# EAGLE design stmboard (EAGLE 9.3.2)
CNAME: Kiss Tamás; CREVISION: 2.0
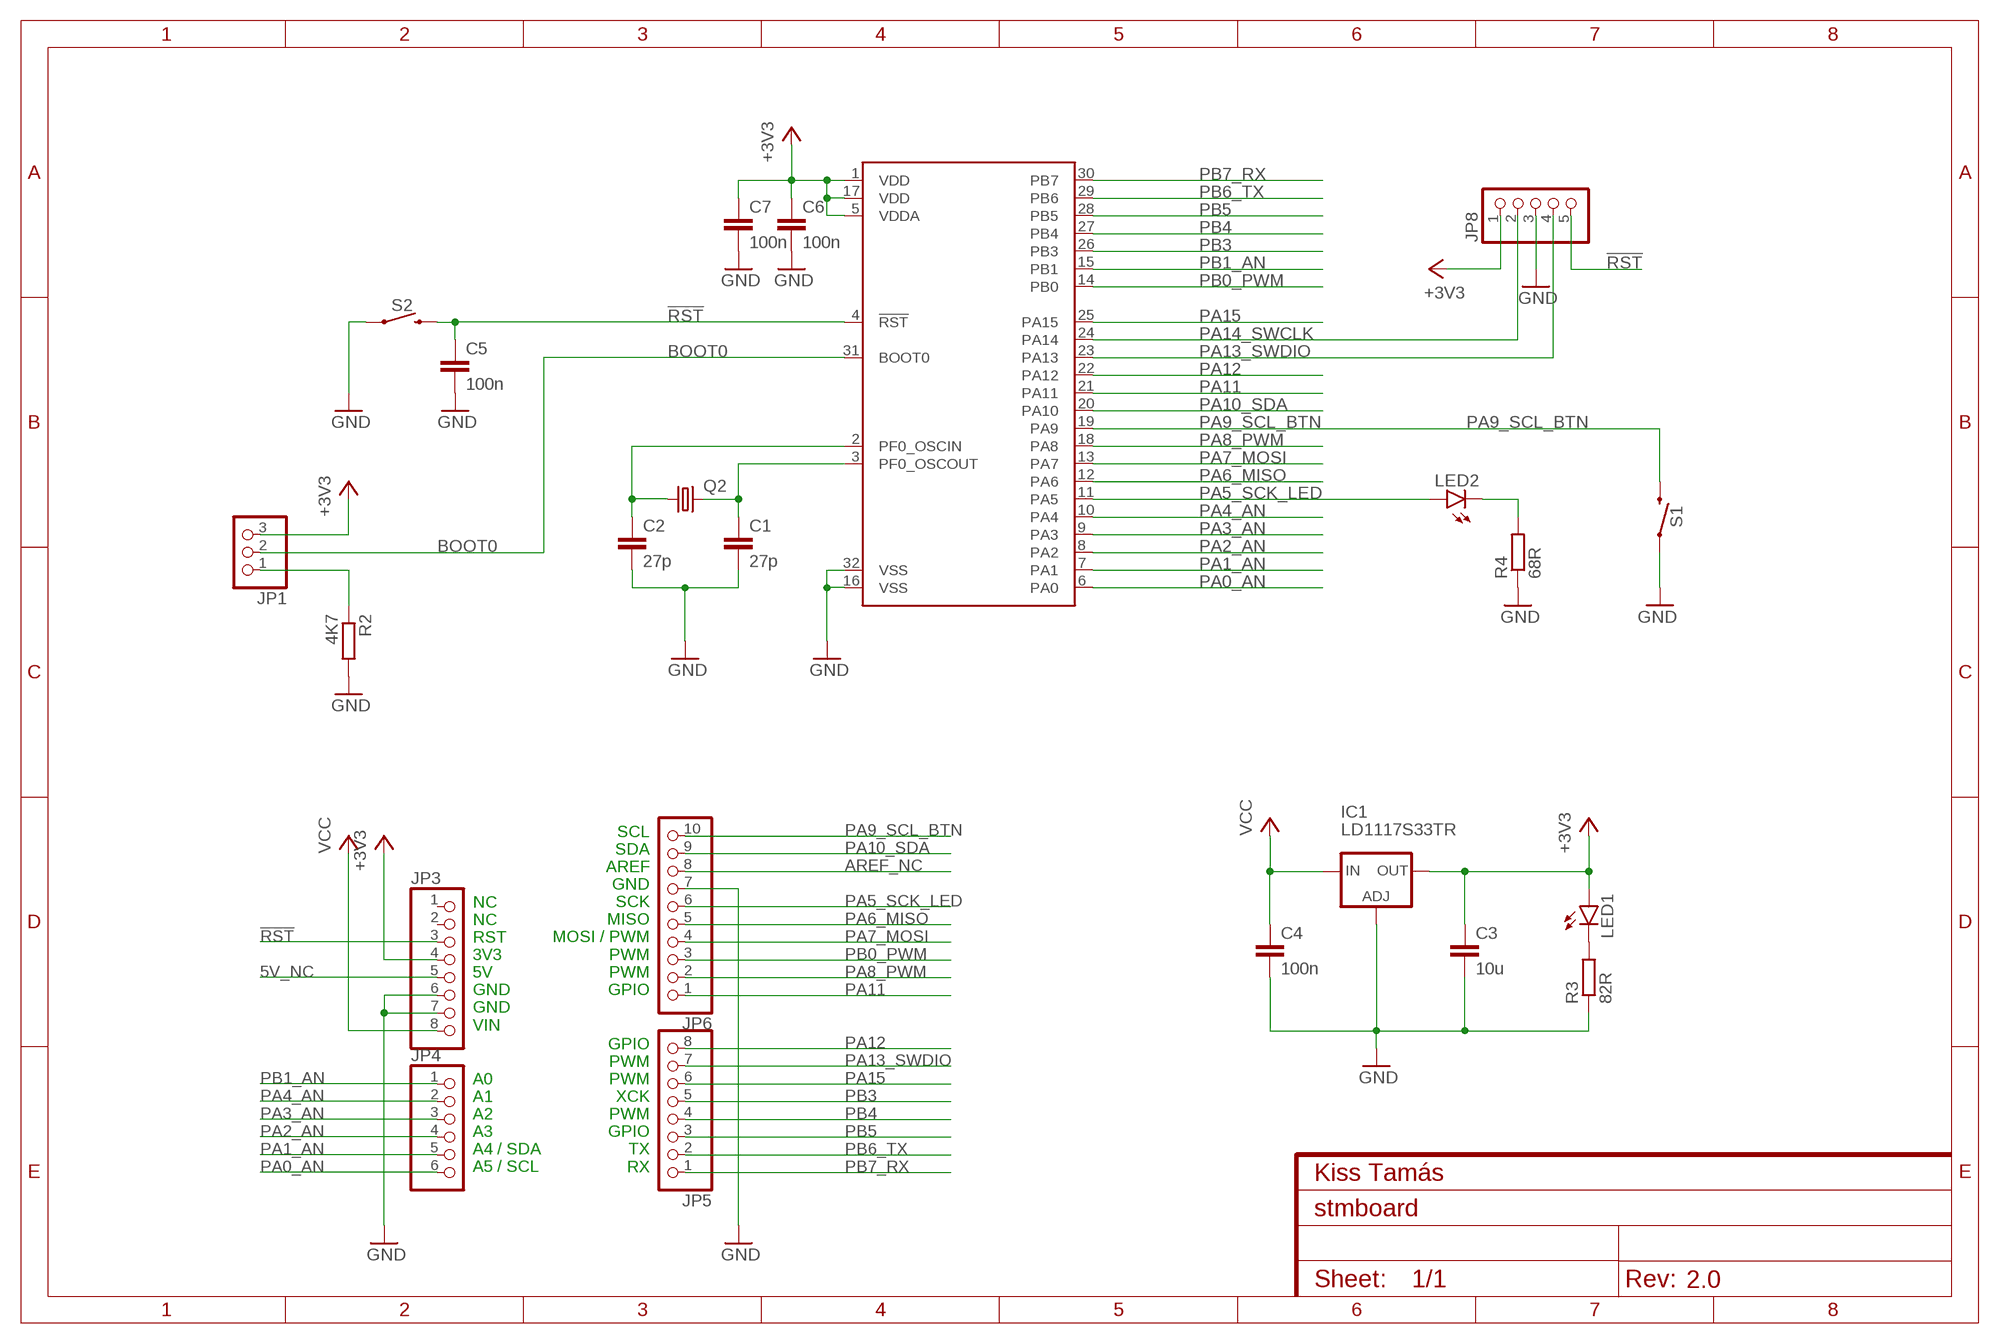
[diagram p0: schematic, sheet 1]

## Parts
C1  27p  C-EUC1206  [C1206]
C2  27p  C-EUC1206  [C1206]
C3  10u  C-EUC1206K  [C1206K]
C4  100n  C-EUC1206K  [C1206K]
C5  100n  C-EUC1206K  [C1206K]
C6  100n  C-EUC1206K  [C1206K]
C7  100n  C-EUC1206K  [C1206K]
IC1  LD1117S33TR  LD117AS12TR  [SOT223]
JP1  PINHD-1X3  [1X03]
JP3  PINHD-1X8  [1X08]
JP4  PINHD-1X6  [1X06]
JP5  PINHD-1X8  [1X08]
JP6  PINHD-1X10  [1X10]
JP8  PINHD-1X5  [1X05]
LED1  LEDSMT1206  [1206]
LED2  LEDSMT1206  [1206]
Q2  CRYSTALSM49  [SM49]
R2  4K7  R-EU_M1206  [M1206]
R3  82R  R-EU_M1206  [M1206]
R4  68R  R-EU_M1206  [M1206]
S1  MOMENTARY-SWITCH-SPST-SMD-6.0X3.5MM  [TACTILE_SWITCH_SMD_6.0X3.5MM]
S2  MOMENTARY-SWITCH-SPST-SMD-6.0X3.5MM  [TACTILE_SWITCH_SMD_6.0X3.5MM]
U$1  STM32F030  [TQFP32-08]

## Nets
5V_NC: JP3.5
!RST: C5.1 JP3.3 JP8.5 S2.2 U$1.4(!RST)
+3V3: C3.1 C6.1 C7.1 IC1.4(OUT) JP1.3 JP3.4 JP8.1 LED1.A U$1.1(VDD) U$1.5(VDDA) U$1.17(VDD)
AREF_NC: JP6.8
BOOT0: JP1.2 U$1.31(BOOT0)
GND: C1.2 C2.2 C3.2 C4.2 C5.2 C6.2 C7.2 IC1.1(ADJ) JP3.6 JP3.7 JP6.7 JP8.3 R2.2 R3.1 R4.1 S1.1 S2.1 U$1.16(VSS) U$1.32(VSS)
N$1: LED1.C R3.2
N$2: LED2.C R4.2
N$3: JP1.1 R2.1
OSCI: C2.1 Q2.1 U$1.2(PF0_OSCIN)
OSCO: C1.1 Q2.2 U$1.3(PF0_OSCOUT)
PA0_AN: JP4.6 U$1.6(PA0)
PA1_AN: JP4.5 U$1.7(PA1)
PA2_AN: JP4.4 U$1.8(PA2)
PA3_AN: JP4.3 U$1.9(PA3)
PA4_AN: JP4.2 U$1.10(PA4)
PA5_SCK_LED: JP6.6 LED2.A U$1.11(PA5)
PA6_MISO: JP6.5 U$1.12(PA6)
PA7_MOSI: JP6.4 U$1.13(PA7)
PA8_PWM: JP6.2 U$1.18(PA8)
PA9_SCL_BTN: JP6.10 S1.2 U$1.19(PA9)
PA10_SDA: JP6.9 U$1.20(PA10)
PA11: JP6.1 U$1.21(PA11)
PA12: JP5.8 U$1.22(PA12)
PA13_SWDIO: JP5.7 JP8.4 U$1.23(PA13)
PA14_SWCLK: JP8.2 U$1.24(PA14)
PA15: JP5.6 U$1.25(PA15)
PB0_PWM: JP6.3 U$1.14(PB0)
PB1_AN: JP4.1 U$1.15(PB1)
PB3: JP5.5 U$1.26(PB3)
PB4: JP5.4 U$1.27(PB4)
PB5: JP5.3 U$1.28(PB5)
PB6_TX: JP5.2 U$1.29(PB6)
PB7_RX: JP5.1 U$1.30(PB7)
VCC: C4.1 IC1.3(IN) JP3.8
Unconnected: JP3.1 JP3.2

## Notes on the sheet
- SCL
  SDA
  AREF
  GND
  SCK
  MISO
  MOSI / PWM
  PWM
  PWM
  GPIO
- NC
  NC
  RST
  3V3
  5V
  GND
  GND
  VIN
- A0
  A1
  A2
  A3
  A4 / SDA
  A5 / SCL
- GPIO
  PWM
  PWM
  XCK
  PWM
  GPIO
  TX
  RX

## Library data of the parts
C1-C7 = rcl:C-EU: CAPACITOR, European symbol
IC1 = v-reg:LD117A?*: Low drop fixed and adjustable positive voltage regulators 1 A Source: http://www.st.com/stonline/products/literature/ds/7194/ld1117axx.pdf
JP1 = pinhead:PINHD-1X3: PIN HEADER
JP3 JP5 = pinhead:PINHD-1X8: PIN HEADER
JP4 = pinhead:PINHD-1X6: PIN HEADER
JP6 = pinhead:PINHD-1X10: PIN HEADER
JP8 = pinhead:PINHD-1X5: PIN HEADER
LED1 LED2 = led:LED: LED OSRAM: - CHIPLED LG R971, LG N971, LY N971, LG Q971, LY Q971, LO R971, LY R971 LH N974, LH R974 LS Q976, LO Q976, LY Q976 LO Q996 - Hyper CHIPLED LW Q18S LB Q993, LB Q99A, LB R99A - SideLED LS A670, LO A670, LY A670, LG A670, LP A670 LB A673, LV A673, LT A673, LW A673 LH A674 LY A675 LS A676, LA A676, LO A676, LY A676, LW A676 LS A679, LY A679, LG A679 - Hyper Micro SIDELED® LS Y876, LA Y876, LO Y876, LY Y876 LT Y87S - SmartLED LW L88C, LW L88S LB L89C, LB L89S, LG L890 LS L89K, LO L89K, LY L89K LS L896, LA L896, LO L896, LY L896 - TOPLED LS T670, LO T670, LY T670, LG T670, LP T670 LSG T670, LSP T670, LSY T670, LOP T670, LYG T670 LG T671, LOG T671, LSG T671 LB T673, LV T673, LT T673, LW T673 LH T674 LS T676, LA T676, LO T676, LY T676, LB T676, LH T676, LSB T676, LW T676 LB T67C, LV T67C, LT T67C, LS T67K, LO T67K, LY T67K, LW E67C LS E67B, LA E67B, LO E67B, LY E67B, LB E67C, LV E67C, LT E67C LW T67C LS T679, LY T679, LG T679 LS T770, LO T770, LY T770, LG T770, LP T770 LB T773, LV T773, LT T773, LW T773 LH T774 LS E675, LA E675, LY E675, LS T675 LS T776, LA T776, LO T776, LY T776, LB T776 LHGB T686 LT T68C, LB T68C - Hyper Mini TOPLED® LB M676 - Mini TOPLED Santana® LG M470 LS M47K, LO M47K, LY M47K Source: http://www.osram.convergy.de LUXEON: - LUMILED® LXK2-PW12-R00, LXK2-PW12-S00, LXK2-PW14-U00, LXK2-PW14-V00 LXK2-PM12-R00, LXK2-PM12-S00, LXK2-PM14-U00 LXK2-PE12-Q00, LXK2-PE12-R00, LXK2-PE12-S00, LXK2-PE14-T00, LXK2-PE14-U00 LXK2-PB12-K00, LXK2-PB12-L00, LXK2-PB12-M00, LXK2-PB14-N00, LXK2-PB14-P00, LXK2-PB14-Q00 LXK2-PR12-L00, LXK2-PR12-M00, LXK2-PR14-Q00, LXK2-PR14-R00 LXK2-PD12-Q00, LXK2-PD12-R00, LXK2-PD12-S00 LXK2-PH12-R00, LXK2-PH12-S00 LXK2-PL12-P00, LXK2-PL12-Q00, LXK2-PL12-R00 Source: www.luxeon.com KINGBRIGHT: KA-3528ASYC Source: www.kingbright.com
Q2 = crystal:CRYSTAL: CRYSTAL; OC_FARNELL: unknown; OC_NEWARK: unknown
R2-R4 = rcl:R-EU_: RESISTOR, European symbol
S1 S2 = SparkFun-Switches:MOMENTARY-SWITCH-SPST: Momentary Switch (Pushbutton) - SPST Normally-open (NO) SPST momentary switches (buttons, pushbuttons). Variants PTH-12MM - 12mm square, through-hole Momentary Pushbutton Switch - 12mm Square <https://www.sparkfun.com/products/9190> (COM-09190) PTH-6.0MM, PTH-6.0MM-KIT - 6.0mm square, through-hole Mini Pushbutton Switch <https://www.sparkfun.com/products/97> (COM-00097) KIT package intended for soldering kit's - only one side of pads' copper is exposed. PTH-RIGHT-ANGLE-KIT - Right-angle, through-hole Right Angle Tactile Button <https://www.sparkfun.com/products/10791> - Used on SparkFun BigTime Watch Kit <https://www.sparkfun.com/products/11734> SMD-12MM - 12mm square, surface-mount Tactile Button - SMD (12mm) <https://www.sparkfun.com/products/12993> (COM-12993) Used on SparkFun PicoBoard <https://www.sparkfun.com/products/11888> SMD-4.5MM - 4.5mm Square Trackball Switch Used on SparkFun Blackberry Trackballer Breakout <https://www.sparkfun.com/products/13169> SMD-4.6MMX2.8MM - 4.60mm x 2.80mm, surface mount Used on SparkFun SAMD21 Mini Breakout <https://www.sparkfun.com/products/13664> SMD-5.2MM, SMD-5.2-REDUNDANT - 5.2mm square, surface-mount Mini Pushbutton Switch - SMD <https://www.sparkfun.com/products/8720> (COM-08720) Used on Arduino Pro Mini <https://www.sparkfun.com/products/11114> REDUNDANT package connects both switch circuits together SMD-6.0X3.5MM - 6.0 x 3.5mm, surface mount Momentary Reset Switch SMD <https://www.sparkfun.com/products/8229> (COM-08229) SMD-6.2MM-TALL - 6.2mm square, surface mount Tactile Button - SMD (6mm) <https://www.sparkfun.com/products/12992> Used on SparkFun Digital Sandbox <https://www.sparkfun.com/products/12651> SMD-RIGHT-ANGLE - Right-angle, surface mount Used on SparkFun Block for Intel® Edison - Arduino <https://www.sparkfun.com/products/13036>; PROD_ID: SWCH-00815; SF_SKU: COM-08229
U$1 = stm32F030x:STM32F030

## Board
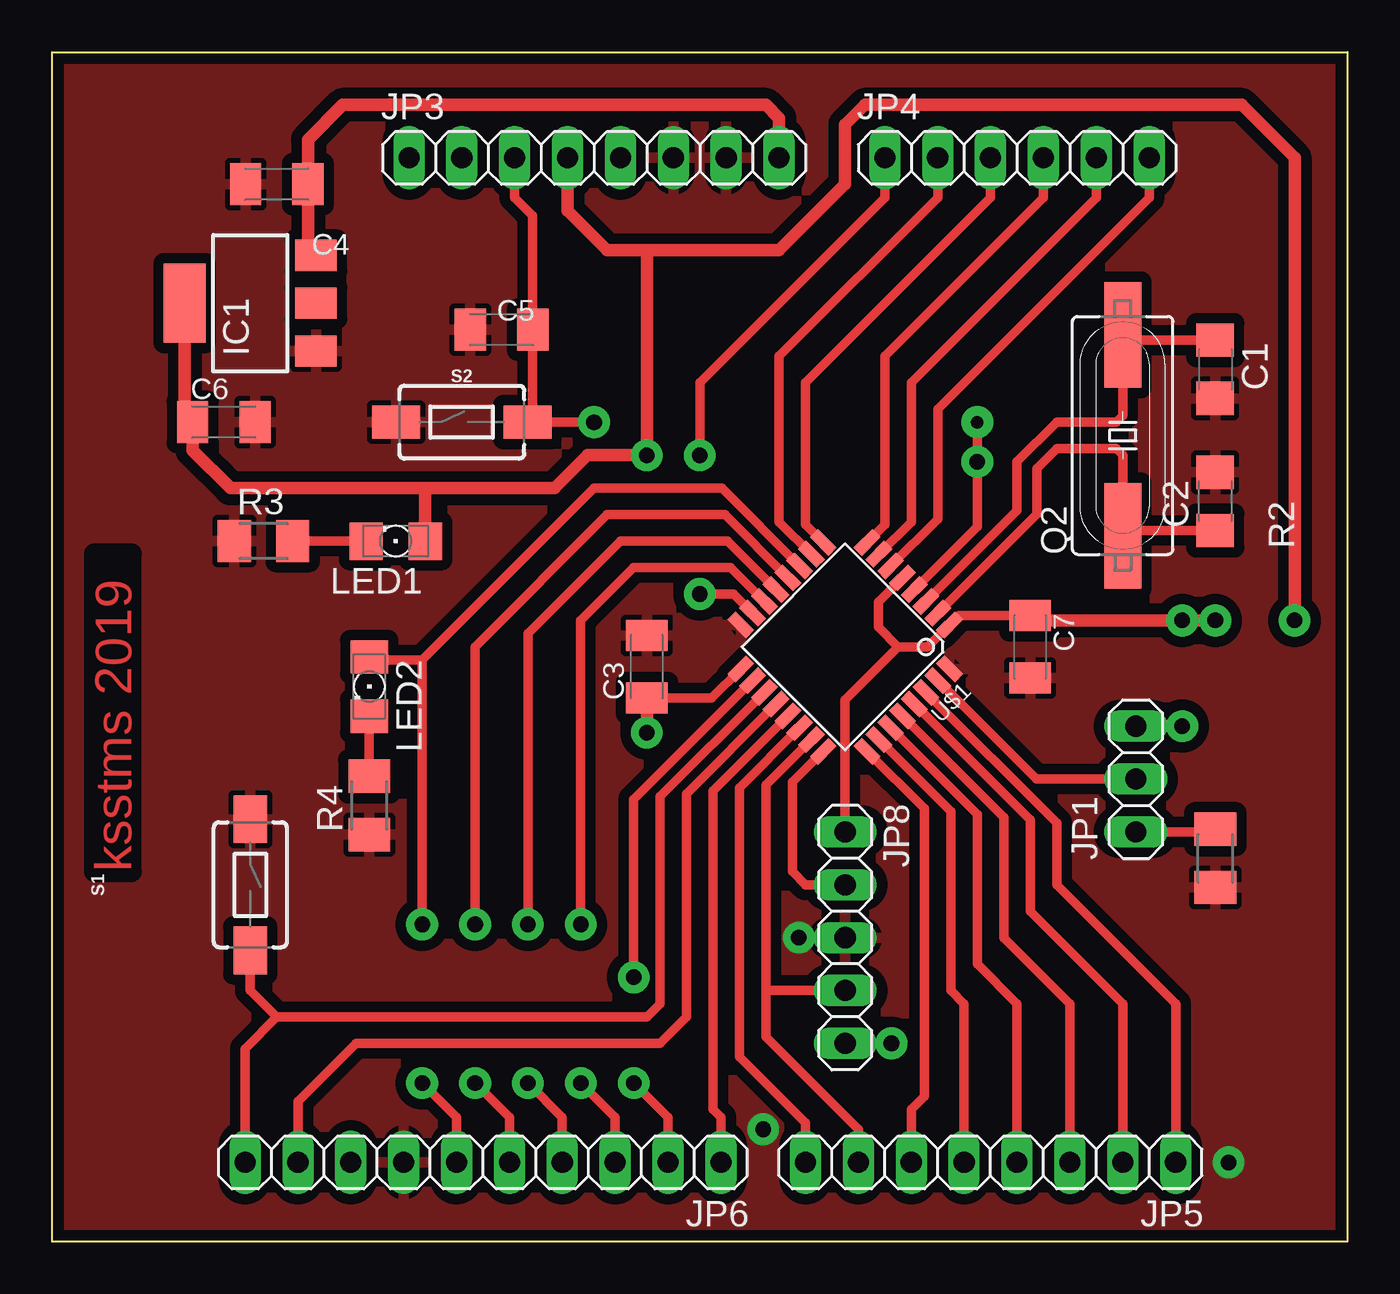
[diagram p1: board, top side]
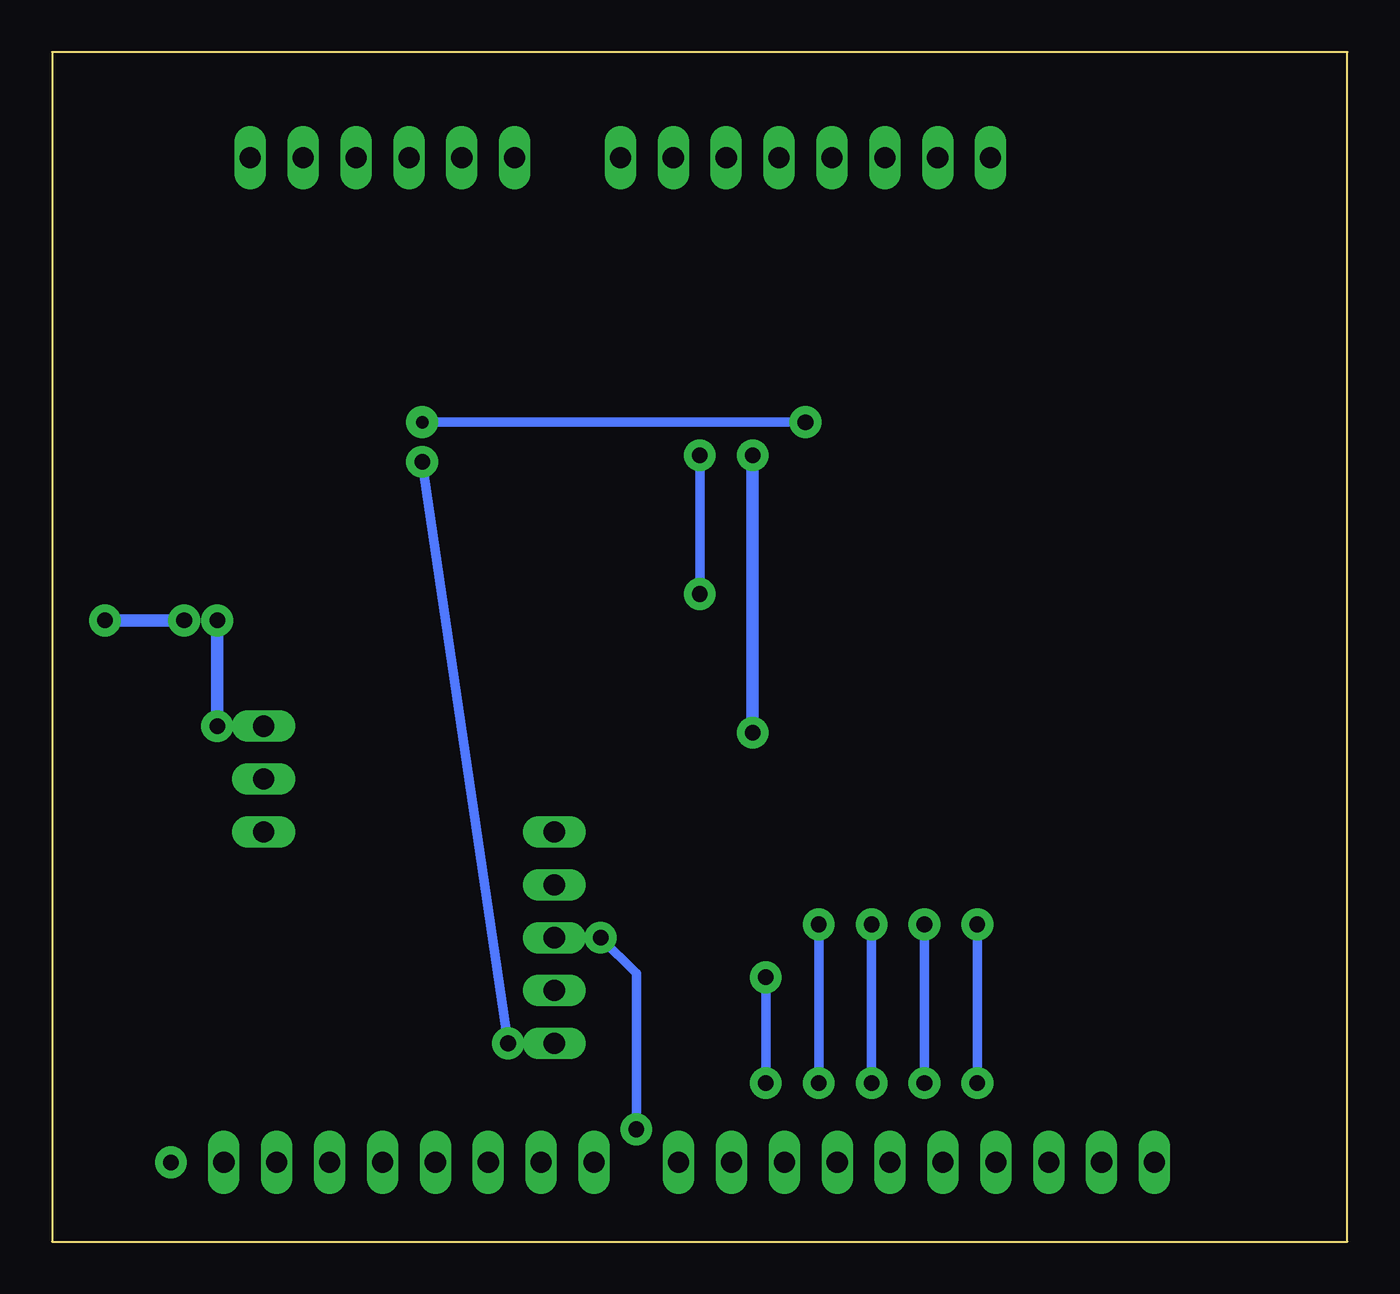
[diagram p2: board, bottom side, seen from below]

Size 62.23 x 57.15 mm. Coordinates in mm from the lower left corner, seen from the top.
Outline: 0,57.15 62.23,57.15 62.23,0 0,0 0,57.15
Copper layers (1*16): Top 0.035mm / dielectric 1.5mm / Bottom 0.035mm
Design rules "default *": minimum track width 6mil, minimum drill 0.35mm, track to track 6mil, track to pad 6mil, pad to pad 6mil, via to via 6mil, smd to smd 6mil, copper to edge 20mil, drill to drill 6mil, minimum pad ring 10mil, minimum via ring 8mil, stop-mask expansion 4mil, vias tented up to drill 0mil, thermal gap 10mil

### Footprints (pad centres in the part's own frame; a part is rotated, then mirrored left to right if it is on the bottom)
C1206 = smd 1.6 x 1.8: 1 -1.4,0; 2 1.4,0
C1206K = smd 1.5 x 2: 1 -1.5,0; 2 1.5,0
SOT223 = smd 1.5 x 2: 1 -2.3,-3.15; 2 0,-3.15; 3 2.3,-3.15 | smd 3.8 x 2: 4 0,3.15
1X03 = drill 1.016 long: 1 -2.54,0; 2 0,0; 3 2.54,0
1X08 = drill 1.016 long: 1 -8.89,0; 2 -6.35,0; 3 -3.81,0; 4 -1.27,0; 5 1.27,0; 6 3.81,0; 7 6.35,0; 8 8.89,0
1X06 = drill 1.016 long: 1 -6.35,0; 2 -3.81,0; 3 -1.27,0; 4 1.27,0; 5 3.81,0; 6 6.35,0
1X10 = drill 1.016 long: 1 -11.43,0; 2 -8.89,0; 3 -6.35,0; 4 -3.81,0; 5 -1.27,0; 6 1.27,0; 7 3.81,0; 8 6.35,0; 9 8.89,0; 10 11.43,0
1X05 = drill 1.016 long: 1 -5.08,0; 2 -2.54,0; 3 0,0; 4 2.54,0; 5 5.08,0
1206 = smd 1.6 x 1.803: A -1.422,0; C 1.422,0
SM49 = smd 5.08 x 1.778: 1 -4.826,0; 2 4.826,0
M1206 = smd 1.6 x 2: 1 -1.4,0; 2 1.4,0
TACTILE_SWITCH_SMD_6.0X3.5MM = smd 2.3 x 1.6: 1 -3.15,0; 2 3.15,0
TQFP32-08 = smd 1.27 x 0.559: 1 -4.293,2.8; 2 -4.293,2; 3 -4.293,1.2; 4 -4.293,0.4; 5 -4.293,-0.4; 6 -4.293,-1.2; 7 -4.293,-2; 8 -4.293,-2.8; 17 4.293,-2.8; 18 4.293,-2; 19 4.293,-1.2; 20 4.293,-0.4; 21 4.293,0.4; 22 4.293,1.2; 23 4.293,2; 24 4.293,2.8 | smd 0.559 x 1.27: 9 -2.8,-4.293; 10 -2,-4.293; 11 -1.2,-4.293; 12 -0.4,-4.293; 13 0.4,-4.293; 14 1.2,-4.293; 15 2,-4.293; 16 2.8,-4.293; 25 2.8,4.293; 26 2,4.293; 27 1.2,4.293; 28 0.4,4.293; 29 -0.4,4.293; 30 -1.2,4.293; 31 -2,4.293; 32 -2.8,4.293

### Placement (x,y rotation side)
C1  55.88,41.91 270 top
C2  55.88,35.56 90 top
C3  28.58,27.62 90 top
C4  10.79,50.8 180 top
C5  21.59,43.81 180 top
C6  8.26,39.37 0 top
C7  46.99,28.58 270 top
IC1  9.53,45.09 90 top
JP1  52.07,22.23 90 top
JP3  26.04,52.07 0 top
JP4  46.36,52.07 0 top
JP5  45.09,3.81 180 top
JP6  20.7,3.81 180 top
JP8  38.1,14.61 270 top
LED1  16.51,33.66 180 top
LED2  15.24,26.67 270 top
Q2  51.44,38.73 90 top
R2  55.88,18.41 270 top
R3  10.16,33.66 0 top
R4  15.24,20.95 90 top
S1  9.53,17.14 270 top
S2  19.69,39.37 0 top
U$1  38.1,28.58 225 top

### Tracks (layer width: path | path; a pad name or v marks a point on that pad's centre or on a via)
!RST  (via drill 0.6 pad 1.52, 0.75 pad 1.52)
  Top 0.457: U$1.4 44.45,34.36 v44.45,37.47 v44.45,39.37 | JP8.5 v40.32,9.53 | v26.04,39.37 22.86,39.37 | 22.86,39.37 S2.2 | 22.86,39.37 23.09,39.6 C5.1 23.09,49.3 22.23,50.16 JP3.3
  Bottom 0.457: v44.45,39.37 v26.04,39.37 | v40.32,9.53 v44.45,37.47
+3V3  (via drill 0.75 pad 1.52)
  Top 0.457: U$1.17 31.69,26.12 C3.1 | U$1.5 39.69,30.73 39.69,29.53 40.64,28.58 | 40.64,28.58 42.06,28.58 U$1.1 43.56,30.08 C7.1 47.22,29.84 | JP8.1 38.1,26.04 40.64,28.58 | 6.37,39.75 C6.1
  Top 0.61: 17.78,36.2 8.57,36.2 6.76,38.01 C6.1 | 17.78,36.2 24.13,36.2 25.72,37.78 v28.58,37.78 28.58,47.62 | JP3.4 24.77,49.53 26.67,47.62 28.58,47.62 | 28.58,47.62 34.93,47.62 38.1,50.8 38.1,53.66 39.05,54.61 57.15,54.61 59.69,52.07 v59.69,29.84 | 47.22,29.84 v55.88,29.84 v54.29,29.84 | IC1.4 6.37,39.75 | C3.1 v28.58,24.45 | LED1.A 17.93,36.04 17.78,36.2 | JP1.3 v54.29,24.77
  Bottom 0.61: v28.58,37.78 v28.58,24.45 | v55.88,29.84 v59.69,29.84 | v54.29,29.84 v54.29,24.77
BOOT0
  Top 0.457: U$1.31 47.28,22.23 JP1.2
GND  (via drill 0.75 pad 1.52)
  Top 0.457: JP8.3 v35.88,14.61
  Bottom 0.457: v35.88,14.61 34.16,12.89 v34.16,5.4
  other vias: 56.52,3.81
  pour Top (isolate 0.508): -1.27,58.42 63.5,58.42 63.5,-1.27 -1.27,-1.27
N$1
  Top 0.457: LED1.C R3.2
N$2
  Top 0.457: LED2.C R4.2
N$3
  Top 0.457: R2.1 55.75,19.69 JP1.1
OSCI
  Top 0.457: U$1.2 47.31,34.95 47.31,37.15 48.26,38.1 51.12,38.1 51.44,37.78 Q2.1 51.69,34.16 C2.1
OSCO
  Top 0.457: U$1.3 46.36,35.13 46.36,37.47 48.26,39.37 51.12,39.37 51.44,39.69 Q2.2 51.69,43.31 C1.1
PA0_AN
  Top 0.457: U$1.6 42.55,34.72 42.55,40.01 52.7,50.16 JP4.6
PA1_AN
  Top 0.457: JP4.5 50.17,50.16 41.27,41.27 41.27,34.58 U$1.7
PA2_AN
  Top 0.457: U$1.8 40.01,34.44 40.01,42.55 47.62,50.16 JP4.4
PA3_AN
  Top 0.457: JP4.3 45.09,50.16 36.2,41.27 36.2,34.44 | U$1.9 36.2,34.44 | 36.2,34.44
PA4_AN
  Top 0.457: JP4.2 42.55,50.16 34.93,42.55 34.93,34.58 U$1.10 | U$1.10
PA5_SCK_LED  (via drill 0.75 pad 1.52)
  Top 0.457: 17.78,27.94 v17.78,15.24 | 17.78,27.94 26.04,36.2 32.18,36.2 | U$1.11 32.18,36.2 | 32.18,36.2 | 17.78,27.94 15.39,27.94 LED2.A | v17.78,7.62 19.43,5.97 JP6.6
  Bottom 0.457: v17.78,15.24 v17.78,7.62
PA6_MISO  (via drill 0.75 pad 1.52)
  Top 0.457: U$1.12 32.32,34.92 26.67,34.92 20.32,28.58 v20.32,15.24 | v20.32,7.62 21.97,5.97 JP6.5
  Bottom 0.457: v20.32,15.24 v20.32,7.62
PA7_MOSI  (via drill 0.75 pad 1.52)
  Top 0.457: v22.86,15.24 22.86,29.21 27.3,33.66 32.45,33.66 U$1.13 | v22.86,7.62 24.51,5.97 JP6.4
  Bottom 0.457: v22.86,15.24 v22.86,7.62
PA8_PWM  (via drill 0.75 pad 1.52)
  Top 0.457: U$1.18 27.94,21.24 v27.94,12.7 | v27.94,7.62 29.59,5.97 JP6.2
  Bottom 0.457: v27.94,12.7 v27.94,7.62
PA9_SCL_BTN
  Top 0.457: U$1.19 29.21,21.38 29.21,11.43 28.58,10.79 10.79,10.79 | 10.79,10.79 9.53,12.07 S1.2 | JP6.10 9.27,9.27 10.79,10.79
PA10_SDA
  Top 0.457: U$1.20 30.48,21.52 30.48,10.79 29.21,9.53 14.6,9.53 11.81,6.73 JP6.9
PA11
  Top 0.457: U$1.21 31.75,21.66 31.75,6.35 32.13,5.97 JP6.1
PA12
  Top 0.457: U$1.22 33.02,21.8 33.02,8.89 36.2,5.71 JP5.8
PA13_SWDIO
  Top 0.457: U$1.23 34.29,21.94 34.29,12.07 | JP5.7 38.73,5.4 34.29,9.84 34.29,12.07 | JP8.4 34.29,12.07
PA14_SWCLK
  Top 0.457: U$1.24 35.56,22.08 35.56,17.78 36.2,17.14 JP8.2
PA15
  Top 0.457: U$1.25 41.91,20.8 41.91,6.99 41.27,6.35 JP5.6
PB0_PWM  (via drill 0.75 pad 1.52)
  Top 0.457: v25.4,15.24 25.4,29.84 27.94,32.38 32.59,32.38 | U$1.14 32.59,32.38 | 32.59,32.38 | v25.4,7.62 27.05,5.97 JP6.3
  Bottom 0.457: v25.4,15.24 v25.4,7.62
PB1_AN  (via drill 0.75 pad 1.52)
  Top 0.457: U$1.15 32.73,31.12 v31.12,31.12 | JP4.1 40.01,50.16 31.12,41.27 v31.12,37.78
  Bottom 0.457: v31.12,37.78 v31.12,31.12
PB3
  Top 0.457: 43.81,3.18 JP5.5 43.81,11.43 43.18,12.07 43.18,20.67 U$1.26
PB4
  Top 0.457: JP5.4 46.36,11.43 44.45,13.34 44.45,20.53 U$1.27
PB5
  Top 0.457: U$1.28 45.72,20.39 45.72,14.61 48.9,11.43 JP5.3
PB6_TX
  Top 0.457: U$1.29 46.99,20.25 46.99,15.88 51.44,11.43 JP5.2
PB7_RX
  Top 0.457: JP5.1 53.97,11.43 48.26,17.14 48.26,20.11 | U$1.30 48.26,20.11 | 48.26,20.11
VCC
  Top 0.457: IC1.3 12.29,47.77
  Top 0.61: JP3.8 34.93,53.98 34.29,54.61 13.97,54.61 12.29,52.93 C4.1 12.29,47.77

### Text on the board
Top: ksstms 2019